# Altium schematic sheet FMC_Metlino_Fabric-Timing.SchDoc
size A4
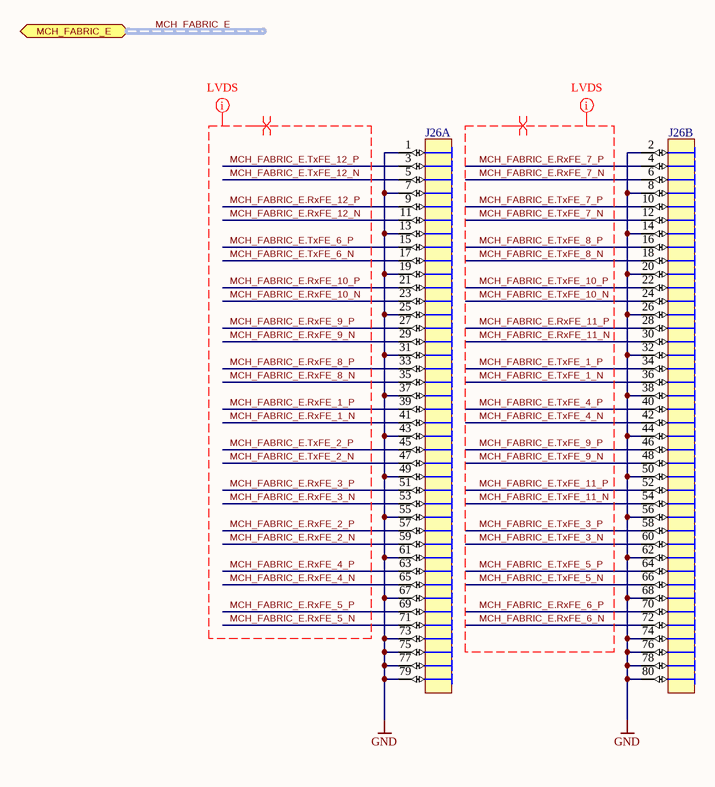
[diagram p0: FMC_Metlino_Fabric-Timing.SchDoc]

## Parts
J26  (no value)  [SAMTEC_FSI-140-XX-X-D-AD_bot]  (parts A,B of 2)  (no BOM)

## Ports
MCH_FABRIC_E (bidir, harness MCH_FABRIC_E)

## Nets
GND: J26.1 J26.2 J26.7 J26.8 J26.13 J26.14 J26.19 J26.20 J26.25 J26.26 J26.31 J26.32 J26.37 J26.38 J26.43 J26.44 J26.49 J26.50 J26.55 J26.56 J26.61 J26.62 J26.67 J26.68 J26.73 J26.74 J26.75 J26.76 J26.77 J26.78 J26.79 J26.80
MCH_FABRIC_E.RxFE_1_N: J26.41
MCH_FABRIC_E.RxFE_1_P: J26.39
MCH_FABRIC_E.RxFE_2_N: J26.59
MCH_FABRIC_E.RxFE_2_P: J26.57
MCH_FABRIC_E.RxFE_3_N: J26.53
MCH_FABRIC_E.RxFE_3_P: J26.51
MCH_FABRIC_E.RxFE_4_N: J26.65
MCH_FABRIC_E.RxFE_4_P: J26.63
MCH_FABRIC_E.RxFE_5_N: J26.71
MCH_FABRIC_E.RxFE_5_P: J26.69
MCH_FABRIC_E.RxFE_6_N: J26.72
MCH_FABRIC_E.RxFE_6_P: J26.70
MCH_FABRIC_E.RxFE_7_N: J26.6
MCH_FABRIC_E.RxFE_7_P: J26.4
MCH_FABRIC_E.RxFE_8_N: J26.35
MCH_FABRIC_E.RxFE_8_P: J26.33
MCH_FABRIC_E.RxFE_9_N: J26.29
MCH_FABRIC_E.RxFE_9_P: J26.27
MCH_FABRIC_E.RxFE_10_N: J26.23
MCH_FABRIC_E.RxFE_10_P: J26.21
MCH_FABRIC_E.RxFE_11_N: J26.30
MCH_FABRIC_E.RxFE_11_P: J26.28
MCH_FABRIC_E.RxFE_12_N: J26.11
MCH_FABRIC_E.RxFE_12_P: J26.9
MCH_FABRIC_E.TxFE_1_N: J26.36
MCH_FABRIC_E.TxFE_1_P: J26.34
MCH_FABRIC_E.TxFE_2_N: J26.47
MCH_FABRIC_E.TxFE_2_P: J26.45
MCH_FABRIC_E.TxFE_3_N: J26.60
MCH_FABRIC_E.TxFE_3_P: J26.58
MCH_FABRIC_E.TxFE_4_N: J26.42
MCH_FABRIC_E.TxFE_4_P: J26.40
MCH_FABRIC_E.TxFE_5_N: J26.66
MCH_FABRIC_E.TxFE_5_P: J26.64
MCH_FABRIC_E.TxFE_6_N: J26.17
MCH_FABRIC_E.TxFE_6_P: J26.15
MCH_FABRIC_E.TxFE_7_N: J26.12
MCH_FABRIC_E.TxFE_7_P: J26.10
MCH_FABRIC_E.TxFE_8_N: J26.18
MCH_FABRIC_E.TxFE_8_P: J26.16
MCH_FABRIC_E.TxFE_9_N: J26.48
MCH_FABRIC_E.TxFE_9_P: J26.46
MCH_FABRIC_E.TxFE_10_N: J26.24
MCH_FABRIC_E.TxFE_10_P: J26.22
MCH_FABRIC_E.TxFE_11_N: J26.54
MCH_FABRIC_E.TxFE_11_P: J26.52
MCH_FABRIC_E.TxFE_12_N: J26.5
MCH_FABRIC_E.TxFE_12_P: J26.3

## Buses and harness runs
harness MCH_FABRIC_E = port MCH_FABRIC_E

## Layout directives
differential pair: MCH_FABRIC_E.RxFE_1_N, MCH_FABRIC_E.RxFE_1_P, MCH_FABRIC_E.RxFE_2_N, MCH_FABRIC_E.RxFE_2_P, MCH_FABRIC_E.RxFE_3_N, MCH_FABRIC_E.RxFE_3_P, MCH_FABRIC_E.RxFE_4_N, MCH_FABRIC_E.RxFE_4_P, MCH_FABRIC_E.RxFE_5_N, MCH_FABRIC_E.RxFE_5_P, MCH_FABRIC_E.RxFE_6_N, MCH_FABRIC_E.RxFE_6_P, MCH_FABRIC_E.RxFE_7_N, MCH_FABRIC_E.RxFE_7_P, MCH_FABRIC_E.RxFE_8_N, MCH_FABRIC_E.RxFE_8_P, MCH_FABRIC_E.RxFE_9_N, MCH_FABRIC_E.RxFE_9_P, MCH_FABRIC_E.RxFE_10_N, MCH_FABRIC_E.RxFE_10_P, MCH_FABRIC_E.RxFE_11_N, MCH_FABRIC_E.RxFE_11_P, MCH_FABRIC_E.RxFE_12_N, MCH_FABRIC_E.RxFE_12_P, MCH_FABRIC_E.TxFE_1_N, MCH_FABRIC_E.TxFE_1_P, MCH_FABRIC_E.TxFE_2_N, MCH_FABRIC_E.TxFE_2_P, MCH_FABRIC_E.TxFE_3_N, MCH_FABRIC_E.TxFE_3_P, MCH_FABRIC_E.TxFE_4_N, MCH_FABRIC_E.TxFE_4_P, MCH_FABRIC_E.TxFE_5_N, MCH_FABRIC_E.TxFE_5_P, MCH_FABRIC_E.TxFE_6_N, MCH_FABRIC_E.TxFE_6_P, MCH_FABRIC_E.TxFE_7_N, MCH_FABRIC_E.TxFE_7_P, MCH_FABRIC_E.TxFE_8_N, MCH_FABRIC_E.TxFE_8_P, MCH_FABRIC_E.TxFE_9_N, MCH_FABRIC_E.TxFE_9_P, MCH_FABRIC_E.TxFE_10_N, MCH_FABRIC_E.TxFE_10_P, MCH_FABRIC_E.TxFE_11_N, MCH_FABRIC_E.TxFE_11_P, MCH_FABRIC_E.TxFE_12_N, MCH_FABRIC_E.TxFE_12_P
net class LVDS: MCH_FABRIC_E.RxFE_1_N, MCH_FABRIC_E.RxFE_1_P, MCH_FABRIC_E.RxFE_2_N, MCH_FABRIC_E.RxFE_2_P, MCH_FABRIC_E.RxFE_3_N, MCH_FABRIC_E.RxFE_3_P, MCH_FABRIC_E.RxFE_4_N, MCH_FABRIC_E.RxFE_4_P, MCH_FABRIC_E.RxFE_5_N, MCH_FABRIC_E.RxFE_5_P, MCH_FABRIC_E.RxFE_6_N, MCH_FABRIC_E.RxFE_6_P, MCH_FABRIC_E.RxFE_7_N, MCH_FABRIC_E.RxFE_7_P, MCH_FABRIC_E.RxFE_8_N, MCH_FABRIC_E.RxFE_8_P, MCH_FABRIC_E.RxFE_9_N, MCH_FABRIC_E.RxFE_9_P, MCH_FABRIC_E.RxFE_10_N, MCH_FABRIC_E.RxFE_10_P, MCH_FABRIC_E.RxFE_11_N, MCH_FABRIC_E.RxFE_11_P, MCH_FABRIC_E.RxFE_12_N, MCH_FABRIC_E.RxFE_12_P, MCH_FABRIC_E.TxFE_1_N, MCH_FABRIC_E.TxFE_1_P, MCH_FABRIC_E.TxFE_2_N, MCH_FABRIC_E.TxFE_2_P, MCH_FABRIC_E.TxFE_3_N, MCH_FABRIC_E.TxFE_3_P, MCH_FABRIC_E.TxFE_4_N, MCH_FABRIC_E.TxFE_4_P, MCH_FABRIC_E.TxFE_5_N, MCH_FABRIC_E.TxFE_5_P, MCH_FABRIC_E.TxFE_6_N, MCH_FABRIC_E.TxFE_6_P, MCH_FABRIC_E.TxFE_7_N, MCH_FABRIC_E.TxFE_7_P, MCH_FABRIC_E.TxFE_8_N, MCH_FABRIC_E.TxFE_8_P, MCH_FABRIC_E.TxFE_9_N, MCH_FABRIC_E.TxFE_9_P, MCH_FABRIC_E.TxFE_10_N, MCH_FABRIC_E.TxFE_10_P, MCH_FABRIC_E.TxFE_11_N, MCH_FABRIC_E.TxFE_11_P, MCH_FABRIC_E.TxFE_12_N, MCH_FABRIC_E.TxFE_12_P

## Library data of the parts
J26 = SAMTEC_FSI-140-10-L-D-AD_bot: Copper Contact Surfaces for Receive 80 Spring Contacts Board to Board & Mezzanine Connectors One-Piece With Alignment Pins; PressFit: No; Part Number: SAMTEC_FSI-140-10-L-D-AD_bot; Component Type: Standard (No BOM); Pin Count: 0; Mounted: Yes; Socket: No; SMD: No; Sense: No; Status: None; Part Description: Copper Contact Surfaces for Receive 80 Spring Contacts Board to Board & Mezzanine Connectors One-Piece With Alignment Pins; ComponentHeight: 0mm; HelpURL: \\cern.ch\dfs\Applications\Altium\Datasheets\SAMTEC_FSI-140-10-L-D-AD.pdf; Author: CERN DEM BC; CreateDate: 08.06.2021; LatestRevisionDate: 08.06.2021